# Altium schematic sheet motordriver-v5.0_top-level.SchDoc
size 863 x 558 mm; SheetNumber: 1; SheetTotal: 13
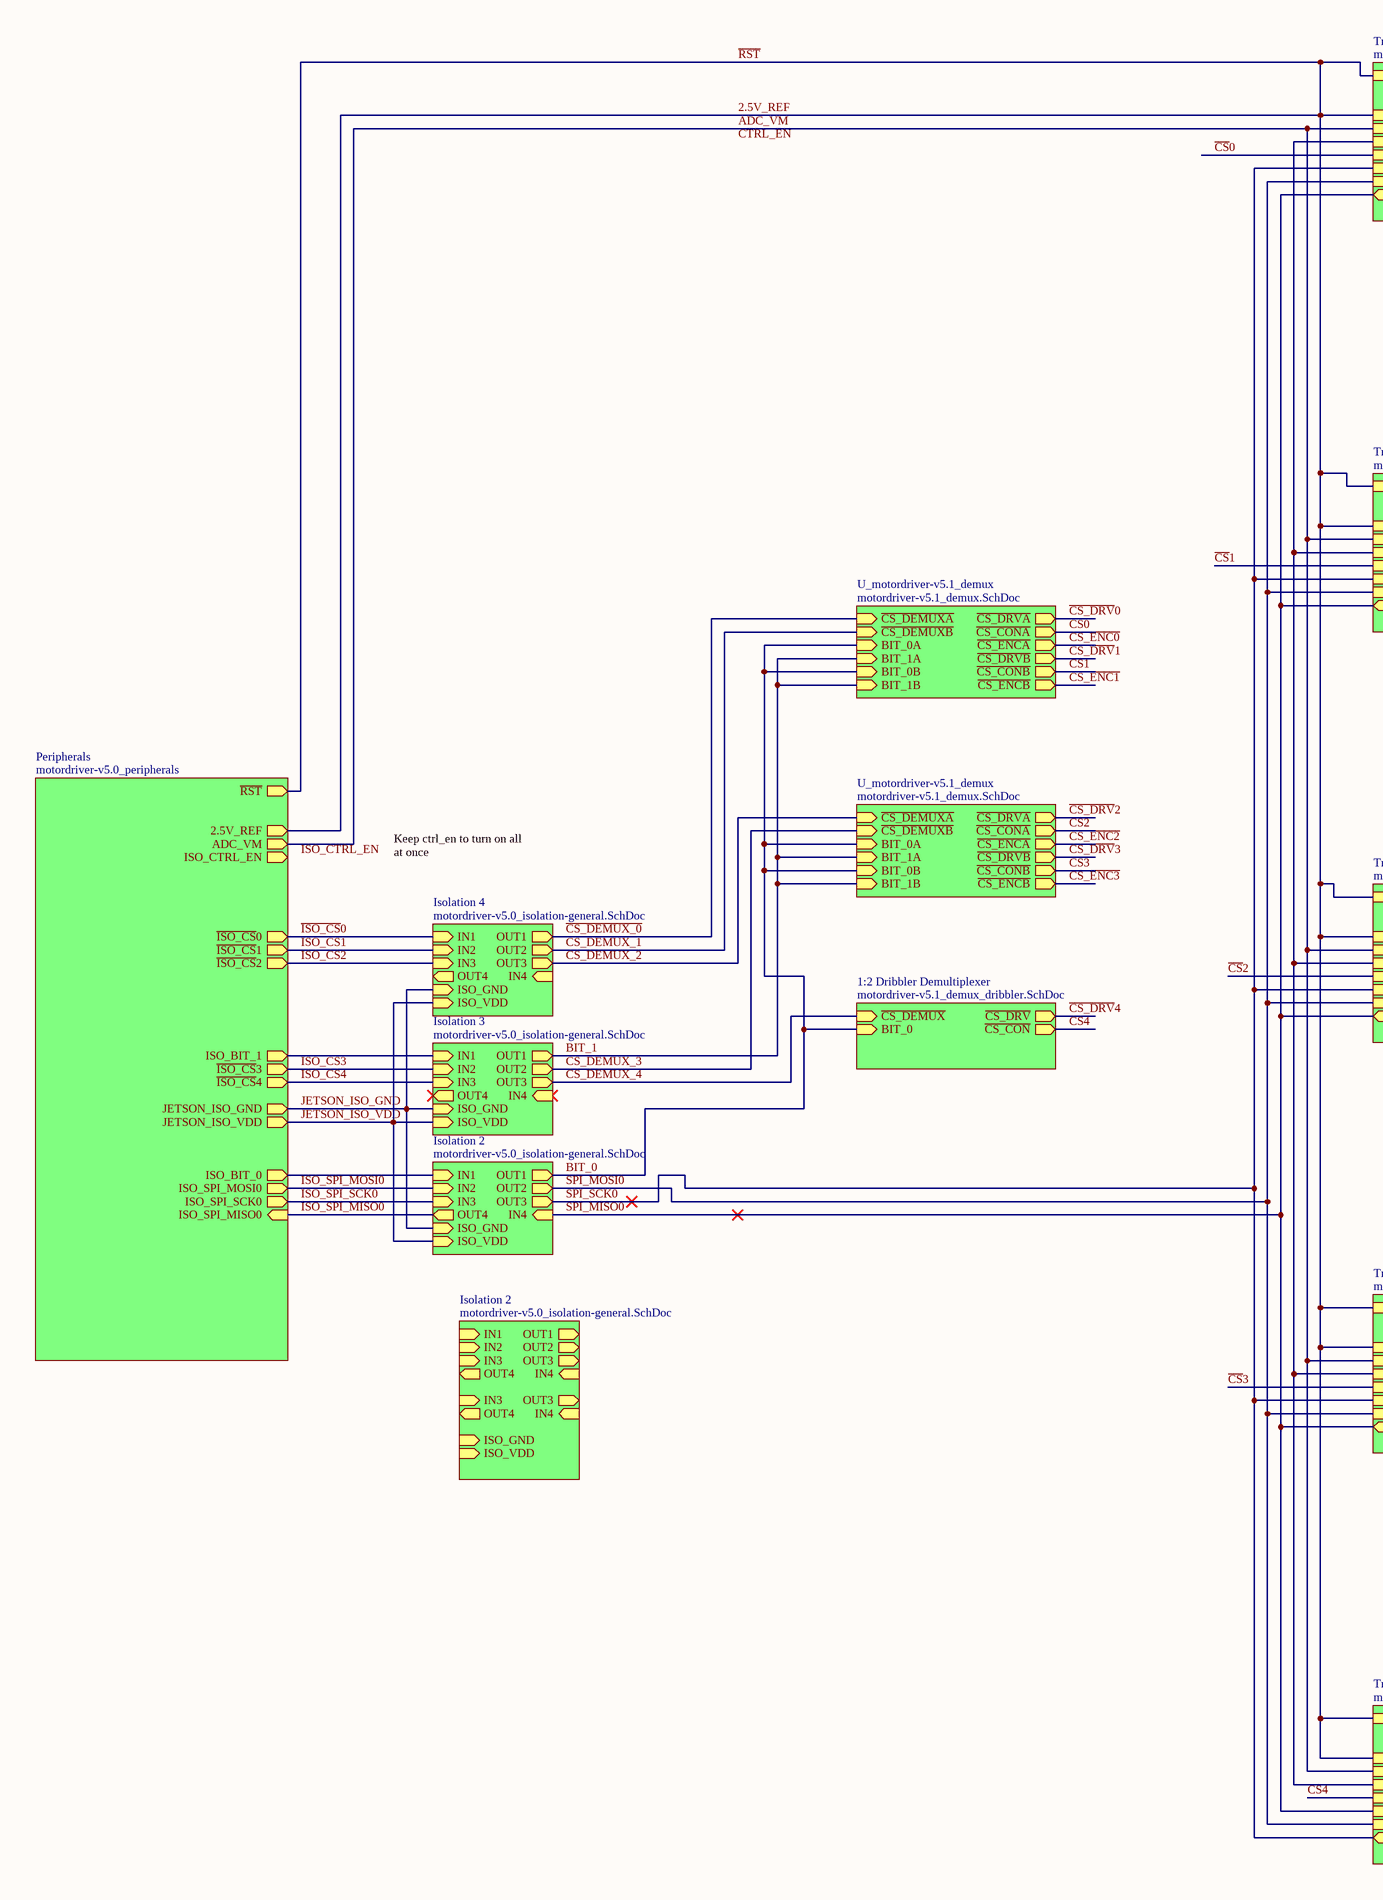
[diagram p0: motordriver-v5.0_top-level.SchDoc, left]
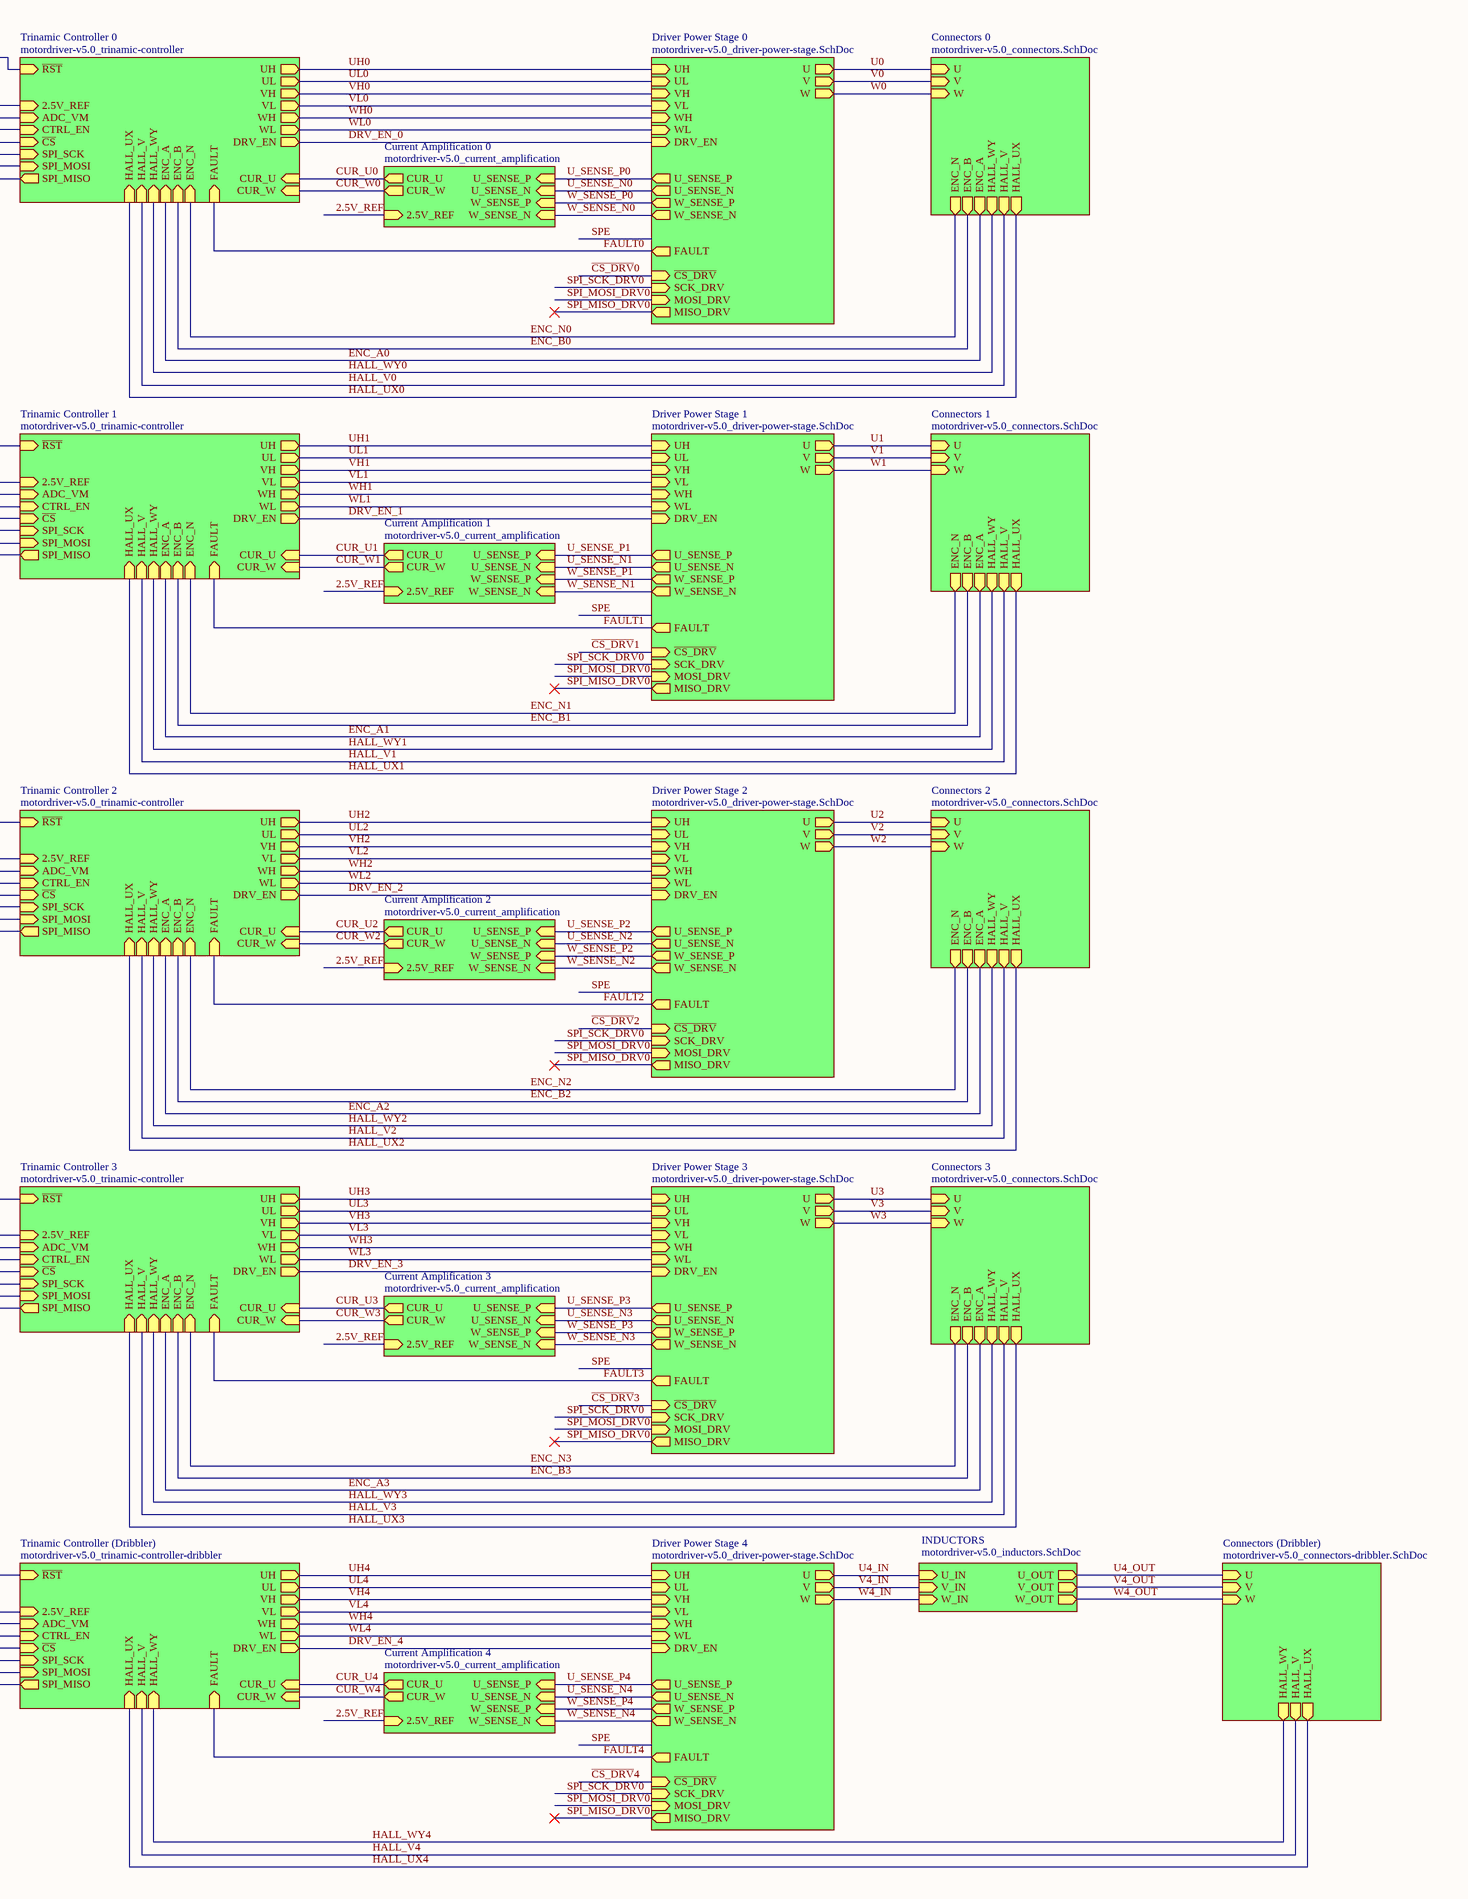
[diagram p1: motordriver-v5.0_top-level.SchDoc, right]

## Sub-sheets
1:2 Dribbler Demultiplexer = motordriver-v5.1_demux_dribbler.SchDoc: ~{CS_DRV} (out), ~{CS_CON} (out), ~{CS_DEMUX} (in), BIT_0 (in)
Connectors 0 = motordriver-v5.0_connectors.SchDoc: U (in), V (in), W (in), HALL_UX (out), HALL_V (out), HALL_WY (out), ENC_A (out), ENC_B (out), ENC_N (out)
Connectors 1 = motordriver-v5.0_connectors.SchDoc: U (in), V (in), W (in), HALL_UX (out), HALL_V (out), HALL_WY (out), ENC_A (out), ENC_B (out), ENC_N (out)
Connectors 2 = motordriver-v5.0_connectors.SchDoc: U (in), V (in), W (in), HALL_UX (out), HALL_V (out), HALL_WY (out), ENC_A (out), ENC_B (out), ENC_N (out)
Connectors 3 = motordriver-v5.0_connectors.SchDoc: U (in), V (in), W (in), HALL_UX (out), HALL_V (out), HALL_WY (out), ENC_A (out), ENC_B (out), ENC_N (out)
Connectors (Dribbler) = motordriver-v5.0_connectors-dribbler.SchDoc: U (in), V (in), W (in), HALL_UX (out), HALL_V (out), HALL_WY (out)
Current Amplification 0 = motordriver-v5.0_current_amplification: CUR_U (out), CUR_W (out), U_SENSE_P (in), U_SENSE_N (in), W_SENSE_N (in), W_SENSE_P (in), 2.5V_REF (in)
Current Amplification 1 = motordriver-v5.0_current_amplification: CUR_U (out), CUR_W (out), U_SENSE_P (in), U_SENSE_N (in), W_SENSE_N (in), W_SENSE_P (in), 2.5V_REF (in)
Current Amplification 2 = motordriver-v5.0_current_amplification: CUR_U (out), CUR_W (out), U_SENSE_P (in), U_SENSE_N (in), W_SENSE_N (in), W_SENSE_P (in), 2.5V_REF (in)
Current Amplification 3 = motordriver-v5.0_current_amplification: CUR_U (out), CUR_W (out), U_SENSE_P (in), U_SENSE_N (in), W_SENSE_N (in), W_SENSE_P (in), 2.5V_REF (in)
Current Amplification 4 = motordriver-v5.0_current_amplification: CUR_U (out), CUR_W (out), U_SENSE_P (in), U_SENSE_N (in), W_SENSE_N (in), W_SENSE_P (in), 2.5V_REF (in)
Driver Power Stage 0 = motordriver-v5.0_driver-power-stage.SchDoc: U (out), V (out), W (out), U_SENSE_P (out), U_SENSE_N (out), DRV_EN (in), UH (in), UL (in), VH (in), VL (in), WH (in), WL (in), FAULT (out), ~{CS_DRV} (in), MISO_DRV (out), MOSI_DRV (in), SCK_DRV (in), W_SENSE_P (out), W_SENSE_N (out)
Driver Power Stage 1 = motordriver-v5.0_driver-power-stage.SchDoc: U (out), V (out), W (out), U_SENSE_P (out), U_SENSE_N (out), DRV_EN (in), UH (in), UL (in), VH (in), VL (in), WH (in), WL (in), FAULT (out), ~{CS_DRV} (in), MISO_DRV (out), MOSI_DRV (in), SCK_DRV (in), W_SENSE_P (out), W_SENSE_N (out)
Driver Power Stage 2 = motordriver-v5.0_driver-power-stage.SchDoc: U (out), V (out), W (out), U_SENSE_P (out), U_SENSE_N (out), DRV_EN (in), UH (in), UL (in), VH (in), VL (in), WH (in), WL (in), FAULT (out), ~{CS_DRV} (in), MISO_DRV (out), MOSI_DRV (in), SCK_DRV (in), W_SENSE_P (out), W_SENSE_N (out)
Driver Power Stage 3 = motordriver-v5.0_driver-power-stage.SchDoc: U (out), V (out), W (out), U_SENSE_P (out), U_SENSE_N (out), DRV_EN (in), UH (in), UL (in), VH (in), VL (in), WH (in), WL (in), FAULT (out), ~{CS_DRV} (in), MISO_DRV (out), MOSI_DRV (in), SCK_DRV (in), W_SENSE_P (out), W_SENSE_N (out)
Driver Power Stage 4 = motordriver-v5.0_driver-power-stage.SchDoc: U (out), V (out), W (out), U_SENSE_P (out), U_SENSE_N (out), DRV_EN (in), UH (in), UL (in), VH (in), VL (in), WH (in), WL (in), FAULT (out), ~{CS_DRV} (in), MISO_DRV (out), MOSI_DRV (in), SCK_DRV (in), W_SENSE_P (out), W_SENSE_N (out)
INDUCTORS = motordriver-v5.0_inductors.SchDoc: U_IN (in), V_IN (in), W_IN (in), V_OUT (out), W_OUT (out), U_OUT (out)
Isolation 2 = motordriver-v5.0_isolation-general.SchDoc: OUT1 (out), IN1 (in), IN2 (in), IN3 (in), OUT4 (out), IN4 (in), OUT3 (out), OUT2 (out), ISO_GND (in), ISO_VDD (in)
Isolation 2 = motordriver-v5.0_isolation-general.SchDoc: OUT1 (out), IN1 (in), IN2 (in), IN3 (in), OUT4 (out), IN4 (in), OUT3 (out), OUT2 (out), ISO_GND (in), ISO_VDD (in), IN3 (in), OUT4 (out), IN4 (in), OUT3 (out)
Isolation 3 = motordriver-v5.0_isolation-general.SchDoc: OUT1 (out), IN1 (in), IN2 (in), IN3 (in), OUT4 (out), IN4 (in), OUT3 (out), OUT2 (out), ISO_GND (in), ISO_VDD (in)
Isolation 4 = motordriver-v5.0_isolation-general.SchDoc: OUT1 (out), IN1 (in), IN2 (in), IN3 (in), OUT4 (out), IN4 (in), OUT3 (out), OUT2 (out), ISO_GND (in), ISO_VDD (in)
Peripherals = motordriver-v5.0_peripherals: ~{RST} (out), ADC_VM (out), ISO_CTRL_EN (out), ISO_SPI_MISO0 (in), JETSON_ISO_VDD (out), JETSON_ISO_GND (out), ~{ISO_CS}1 (out), ~{ISO_CS}2 (out), ~{ISO_CS}4 (out), 2.5V_REF (out), ~{ISO_CS}0 (out), ISO_BIT_1 (out), ~{ISO_CS}3 (out), ISO_SPI_MOSI0 (out), ISO_SPI_SCK0 (out), ISO_BIT_0 (out)
Trinamic Controller 0 = motordriver-v5.0_trinamic-controller: ~{RST} (in), CUR_U (in), CUR_W (in), DRV_EN (out), ADC_VM (in), CTRL_EN (in), UH (out), UL (out), VH (out), VL (out), WH (out), WL (out), HALL_UX (in), HALL_V (in), HALL_WY (in), ENC_A (in), ENC_B (in), ENC_N (in), ~{CS} (in), SPI_MISO (out), SPI_MOSI (in), SPI_SCK (in), 2.5V_REF (in), FAULT (in)
Trinamic Controller 1 = motordriver-v5.0_trinamic-controller: ~{RST} (in), CUR_U (in), CUR_W (in), DRV_EN (out), ADC_VM (in), CTRL_EN (in), UH (out), UL (out), VH (out), VL (out), WH (out), WL (out), HALL_UX (in), HALL_V (in), HALL_WY (in), ENC_A (in), ENC_B (in), ENC_N (in), ~{CS} (in), SPI_MISO (out), SPI_MOSI (in), SPI_SCK (in), 2.5V_REF (in), FAULT (in)
Trinamic Controller 2 = motordriver-v5.0_trinamic-controller: ~{RST} (in), CUR_U (in), CUR_W (in), DRV_EN (out), ADC_VM (in), CTRL_EN (in), UH (out), UL (out), VH (out), VL (out), WH (out), WL (out), HALL_UX (in), HALL_V (in), HALL_WY (in), ENC_A (in), ENC_B (in), ENC_N (in), ~{CS} (in), SPI_MISO (out), SPI_MOSI (in), SPI_SCK (in), 2.5V_REF (in), FAULT (in)
Trinamic Controller 3 = motordriver-v5.0_trinamic-controller: ~{RST} (in), CUR_U (in), CUR_W (in), DRV_EN (out), ADC_VM (in), CTRL_EN (in), UH (out), UL (out), VH (out), VL (out), WH (out), WL (out), HALL_UX (in), HALL_V (in), HALL_WY (in), ENC_A (in), ENC_B (in), ENC_N (in), ~{CS} (in), SPI_MISO (out), SPI_MOSI (in), SPI_SCK (in), 2.5V_REF (in), FAULT (in)
Trinamic Controller (Dribbler) = motordriver-v5.0_trinamic-controller-dribbler: ~{RST} (in), CUR_U (in), CUR_W (in), DRV_EN (out), UH (out), UL (out), VH (out), VL (out), WH (out), WL (out), HALL_UX (in), HALL_V (in), HALL_WY (in), ADC_VM (in), CTRL_EN (in), ~{CS} (in), SPI_MISO (out), SPI_MOSI (in), SPI_SCK (in), 2.5V_REF (in), FAULT (in)
U_motordriver-v5.1_demux = motordriver-v5.1_demux.SchDoc: ~{CS_DEMUXA} (in), ~{CS_DRVA} (out), ~{CS_CONA} (out), ~{CS_ENCA} (out), ~{CS_DEMUXB} (in), ~{CS_DRVB} (out), ~{CS_CONB} (out), ~{CS_ENCB} (out), BIT_0A (in), BIT_1A (in), BIT_0B (in), BIT_1B (in)
U_motordriver-v5.1_demux = motordriver-v5.1_demux.SchDoc: ~{CS_DEMUXA} (in), ~{CS_DRVA} (out), ~{CS_CONA} (out), ~{CS_ENCA} (out), ~{CS_DEMUXB} (in), ~{CS_DRVB} (out), ~{CS_CONB} (out), ~{CS_ENCB} (out), BIT_0A (in), BIT_1A (in), BIT_0B (in), BIT_1B (in)

## Nets
2.5V_REF: sheet Peripherals/~{RST}, sheet Peripherals/2.5V_REF, sheet Trinamic Controller (Dribbler)/~{RST}, sheet Trinamic Controller (Dribbler)/2.5V_REF, sheet Trinamic Controller 0/~{RST}, sheet Trinamic Controller 0/2.5V_REF, sheet Current Amplification 0/2.5V_REF, sheet Trinamic Controller 1/~{RST}, sheet Trinamic Controller 1/2.5V_REF, sheet Current Amplification 1/2.5V_REF, sheet Trinamic Controller 2/~{RST}, sheet Trinamic Controller 2/2.5V_REF, sheet Current Amplification 2/2.5V_REF, sheet Trinamic Controller 3/~{RST}, sheet Trinamic Controller 3/2.5V_REF, sheet Current Amplification 3/2.5V_REF, sheet Current Amplification 4/2.5V_REF  [also labelled ~{RST}]
ADC_VM: sheet Peripherals/ADC_VM, sheet Trinamic Controller (Dribbler)/ADC_VM, sheet Trinamic Controller 0/ADC_VM, sheet Trinamic Controller 1/ADC_VM, sheet Trinamic Controller 2/ADC_VM, sheet Trinamic Controller 3/ADC_VM
BIT_0: sheet Isolation 2/OUT1, sheet 1:2 Dribbler Demultiplexer/BIT_0, sheet U_motordriver-v5.1_demux/BIT_0A, sheet U_motordriver-v5.1_demux/BIT_0B, sheet U_motordriver-v5.1_demux/BIT_0A, sheet U_motordriver-v5.1_demux/BIT_0B
BIT_1: sheet U_motordriver-v5.1_demux/BIT_1A, sheet U_motordriver-v5.1_demux/BIT_1B, sheet U_motordriver-v5.1_demux/BIT_1A, sheet U_motordriver-v5.1_demux/BIT_1B, sheet Isolation 3/OUT1
~{CS}0: sheet Trinamic Controller 0/~{CS}, sheet U_motordriver-v5.1_demux/~{CS_CONA}
~{CS}1: sheet Trinamic Controller 1/~{CS}, sheet U_motordriver-v5.1_demux/~{CS_CONB}
~{CS}2: sheet Trinamic Controller 2/~{CS}, sheet U_motordriver-v5.1_demux/~{CS_CONA}
~{CS}3: sheet Trinamic Controller 3/~{CS}, sheet U_motordriver-v5.1_demux/~{CS_CONB}
~{CS}4: sheet Trinamic Controller (Dribbler)/~{CS}, sheet 1:2 Dribbler Demultiplexer/~{CS_CON}
~{CS_DEMUX_0}: sheet U_motordriver-v5.1_demux/~{CS_DEMUXA}, sheet Isolation 4/OUT1
~{CS_DEMUX_1}: sheet U_motordriver-v5.1_demux/~{CS_DEMUXB}, sheet Isolation 4/OUT2
~{CS_DEMUX_2}: sheet U_motordriver-v5.1_demux/~{CS_DEMUXA}, sheet Isolation 4/OUT3
~{CS_DEMUX_3}: sheet U_motordriver-v5.1_demux/~{CS_DEMUXB}, sheet Isolation 3/OUT2
~{CS_DEMUX_4}: sheet 1:2 Dribbler Demultiplexer/~{CS_DEMUX}, sheet Isolation 3/OUT3
~{CS_DRV}0: sheet Driver Power Stage 0/~{CS_DRV}, sheet U_motordriver-v5.1_demux/~{CS_DRVA}
~{CS_DRV}1: sheet Driver Power Stage 1/~{CS_DRV}, sheet U_motordriver-v5.1_demux/~{CS_DRVB}
~{CS_DRV}2: sheet Driver Power Stage 2/~{CS_DRV}, sheet U_motordriver-v5.1_demux/~{CS_DRVA}
~{CS_DRV}3: sheet Driver Power Stage 3/~{CS_DRV}, sheet U_motordriver-v5.1_demux/~{CS_DRVB}
~{CS_DRV}4: sheet Driver Power Stage 4/~{CS_DRV}, sheet 1:2 Dribbler Demultiplexer/~{CS_DRV}
~{CS_ENC0}: sheet U_motordriver-v5.1_demux/~{CS_ENCA}
~{CS_ENC1}: sheet U_motordriver-v5.1_demux/~{CS_ENCB}
~{CS_ENC2}: sheet U_motordriver-v5.1_demux/~{CS_ENCA}
~{CS_ENC3}: sheet U_motordriver-v5.1_demux/~{CS_ENCB}
CUR_U0: sheet Trinamic Controller 0/CUR_U, sheet Current Amplification 0/CUR_U
CUR_U1: sheet Trinamic Controller 1/CUR_U, sheet Current Amplification 1/CUR_U
CUR_U2: sheet Trinamic Controller 2/CUR_U, sheet Current Amplification 2/CUR_U
CUR_U3: sheet Trinamic Controller 3/CUR_U, sheet Current Amplification 3/CUR_U
CUR_U4: sheet Trinamic Controller (Dribbler)/CUR_U, sheet Current Amplification 4/CUR_U
CUR_W0: sheet Trinamic Controller 0/CUR_W, sheet Current Amplification 0/CUR_W
CUR_W1: sheet Trinamic Controller 1/CUR_W, sheet Current Amplification 1/CUR_W
CUR_W2: sheet Trinamic Controller 2/CUR_W, sheet Current Amplification 2/CUR_W
CUR_W3: sheet Trinamic Controller 3/CUR_W, sheet Current Amplification 3/CUR_W
CUR_W4: sheet Trinamic Controller (Dribbler)/CUR_W, sheet Current Amplification 4/CUR_W
DRV_EN_0: sheet Driver Power Stage 0/DRV_EN, sheet Trinamic Controller 0/DRV_EN
DRV_EN_1: sheet Driver Power Stage 1/DRV_EN, sheet Trinamic Controller 1/DRV_EN
DRV_EN_2: sheet Driver Power Stage 2/DRV_EN, sheet Trinamic Controller 2/DRV_EN
DRV_EN_3: sheet Driver Power Stage 3/DRV_EN, sheet Trinamic Controller 3/DRV_EN
DRV_EN_4: sheet Trinamic Controller (Dribbler)/DRV_EN, sheet Driver Power Stage 4/DRV_EN
ENC_A0: sheet Trinamic Controller 0/ENC_A, sheet Connectors 0/ENC_A
ENC_A1: sheet Trinamic Controller 1/ENC_A, sheet Connectors 1/ENC_A
ENC_A2: sheet Trinamic Controller 2/ENC_A, sheet Connectors 2/ENC_A
ENC_A3: sheet Trinamic Controller 3/ENC_A, sheet Connectors 3/ENC_A
ENC_B0: sheet Trinamic Controller 0/ENC_B, sheet Connectors 0/ENC_B
ENC_B1: sheet Trinamic Controller 1/ENC_B, sheet Connectors 1/ENC_B
ENC_B2: sheet Trinamic Controller 2/ENC_B, sheet Connectors 2/ENC_B
ENC_B3: sheet Trinamic Controller 3/ENC_B, sheet Connectors 3/ENC_B
ENC_N0: sheet Trinamic Controller 0/ENC_N, sheet Connectors 0/ENC_N
ENC_N1: sheet Trinamic Controller 1/ENC_N, sheet Connectors 1/ENC_N
ENC_N2: sheet Trinamic Controller 2/ENC_N, sheet Connectors 2/ENC_N
ENC_N3: sheet Trinamic Controller 3/ENC_N, sheet Connectors 3/ENC_N
FAULT0: sheet Driver Power Stage 0/FAULT, sheet Trinamic Controller 0/FAULT
FAULT1: sheet Driver Power Stage 1/FAULT, sheet Trinamic Controller 1/FAULT
FAULT2: sheet Driver Power Stage 2/FAULT, sheet Trinamic Controller 2/FAULT
FAULT3: sheet Driver Power Stage 3/FAULT, sheet Trinamic Controller 3/FAULT
FAULT4: sheet Trinamic Controller (Dribbler)/FAULT, sheet Driver Power Stage 4/FAULT
HALL_UX0: sheet Trinamic Controller 0/HALL_UX, sheet Connectors 0/HALL_UX
HALL_UX1: sheet Trinamic Controller 1/HALL_UX, sheet Connectors 1/HALL_UX
HALL_UX2: sheet Trinamic Controller 2/HALL_UX, sheet Connectors 2/HALL_UX
HALL_UX3: sheet Trinamic Controller 3/HALL_UX, sheet Connectors 3/HALL_UX
HALL_UX4: sheet Trinamic Controller (Dribbler)/HALL_UX, sheet Connectors (Dribbler)/HALL_UX
HALL_V0: sheet Trinamic Controller 0/HALL_V, sheet Connectors 0/HALL_V
HALL_V1: sheet Trinamic Controller 1/HALL_V, sheet Connectors 1/HALL_V
HALL_V2: sheet Trinamic Controller 2/HALL_V, sheet Connectors 2/HALL_V
HALL_V3: sheet Trinamic Controller 3/HALL_V, sheet Connectors 3/HALL_V
HALL_V4: sheet Trinamic Controller (Dribbler)/HALL_V, sheet Connectors (Dribbler)/HALL_V
HALL_WY0: sheet Trinamic Controller 0/HALL_WY, sheet Connectors 0/HALL_WY
HALL_WY1: sheet Trinamic Controller 1/HALL_WY, sheet Connectors 1/HALL_WY
HALL_WY2: sheet Trinamic Controller 2/HALL_WY, sheet Connectors 2/HALL_WY
HALL_WY3: sheet Trinamic Controller 3/HALL_WY, sheet Connectors 3/HALL_WY
HALL_WY4: sheet Trinamic Controller (Dribbler)/HALL_WY, sheet Connectors (Dribbler)/HALL_WY
~{ISO_CS}0: sheet Peripherals/~{ISO_CS}0, sheet Isolation 4/IN1
~{ISO_CS}1: sheet Peripherals/~{ISO_CS}1, sheet Isolation 4/IN2
~{ISO_CS}2: sheet Peripherals/~{ISO_CS}2, sheet Isolation 4/IN3
~{ISO_CS}3: sheet Peripherals/~{ISO_CS}3, sheet Isolation 3/IN2
~{ISO_CS}4: sheet Peripherals/~{ISO_CS}4, sheet Isolation 3/IN3
ISO_SPI_MISO0: sheet Peripherals/ISO_SPI_MISO0, sheet Isolation 2/OUT4
ISO_SPI_MOSI0: sheet Peripherals/ISO_SPI_MOSI0, sheet Isolation 2/IN2
ISO_SPI_SCK0: sheet Peripherals/ISO_SPI_SCK0, sheet Isolation 2/IN3
JETSON_ISO_GND: sheet Peripherals/JETSON_ISO_GND, sheet Isolation 2/ISO_GND, sheet Isolation 3/ISO_GND, sheet Isolation 4/ISO_GND
JETSON_ISO_VDD: sheet Peripherals/JETSON_ISO_VDD, sheet Isolation 2/ISO_VDD, sheet Isolation 3/ISO_VDD, sheet Isolation 4/ISO_VDD
SPI_MISO0: sheet Trinamic Controller (Dribbler)/SPI_SCK, sheet Trinamic Controller 0/SPI_MISO, sheet Isolation 2/IN4, sheet Trinamic Controller 1/SPI_MISO, sheet Trinamic Controller 2/SPI_MISO, sheet Trinamic Controller 3/SPI_MISO
SPI_MISO_DRV0: sheet Driver Power Stage 0/MISO_DRV, sheet Driver Power Stage 1/MISO_DRV, sheet Driver Power Stage 2/MISO_DRV, sheet Driver Power Stage 3/MISO_DRV, sheet Driver Power Stage 4/MISO_DRV
SPI_MOSI0: sheet Trinamic Controller (Dribbler)/SPI_MOSI, sheet Trinamic Controller 0/SPI_MOSI, sheet Isolation 2/OUT2, sheet Trinamic Controller 1/SPI_MOSI, sheet Trinamic Controller 2/SPI_MOSI, sheet Trinamic Controller 3/SPI_MOSI
SPI_MOSI_DRV0: sheet Driver Power Stage 0/MOSI_DRV, sheet Driver Power Stage 1/MOSI_DRV, sheet Driver Power Stage 2/MOSI_DRV, sheet Driver Power Stage 3/MOSI_DRV, sheet Driver Power Stage 4/MOSI_DRV
SPI_SCK0: sheet Trinamic Controller (Dribbler)/SPI_MISO, sheet Trinamic Controller 0/SPI_SCK, sheet Isolation 2/OUT3, sheet Trinamic Controller 1/SPI_SCK, sheet Trinamic Controller 2/SPI_SCK, sheet Trinamic Controller 3/SPI_SCK
SPI_SCK_DRV0: sheet Driver Power Stage 0/SCK_DRV, sheet Driver Power Stage 1/SCK_DRV, sheet Driver Power Stage 2/SCK_DRV, sheet Driver Power Stage 3/SCK_DRV, sheet Driver Power Stage 4/SCK_DRV
U0: sheet Driver Power Stage 0/U, sheet Connectors 0/U
U1: sheet Driver Power Stage 1/U, sheet Connectors 1/U
U2: sheet Driver Power Stage 2/U, sheet Connectors 2/U
U3: sheet Driver Power Stage 3/U, sheet Connectors 3/U
U4_IN: sheet INDUCTORS/U_IN, sheet Driver Power Stage 4/U
U4_OUT: sheet INDUCTORS/U_OUT, sheet Connectors (Dribbler)/U
U_SENSE_N0: sheet Driver Power Stage 0/U_SENSE_N, sheet Current Amplification 0/U_SENSE_N
U_SENSE_N1: sheet Driver Power Stage 1/U_SENSE_N, sheet Current Amplification 1/U_SENSE_N
U_SENSE_N2: sheet Driver Power Stage 2/U_SENSE_N, sheet Current Amplification 2/U_SENSE_N
U_SENSE_N3: sheet Driver Power Stage 3/U_SENSE_N, sheet Current Amplification 3/U_SENSE_N
U_SENSE_N4: sheet Driver Power Stage 4/U_SENSE_N, sheet Current Amplification 4/U_SENSE_N
U_SENSE_P0: sheet Driver Power Stage 0/U_SENSE_P, sheet Current Amplification 0/U_SENSE_P
U_SENSE_P1: sheet Driver Power Stage 1/U_SENSE_P, sheet Current Amplification 1/U_SENSE_P
U_SENSE_P2: sheet Driver Power Stage 2/U_SENSE_P, sheet Current Amplification 2/U_SENSE_P
U_SENSE_P3: sheet Driver Power Stage 3/U_SENSE_P, sheet Current Amplification 3/U_SENSE_P
U_SENSE_P4: sheet Driver Power Stage 4/U_SENSE_P, sheet Current Amplification 4/U_SENSE_P
UH0: sheet Driver Power Stage 0/UH, sheet Trinamic Controller 0/UH
UH1: sheet Driver Power Stage 1/UH, sheet Trinamic Controller 1/UH
UH2: sheet Driver Power Stage 2/UH, sheet Trinamic Controller 2/UH
UH3: sheet Driver Power Stage 3/UH, sheet Trinamic Controller 3/UH
UH4: sheet Trinamic Controller (Dribbler)/UH, sheet Driver Power Stage 4/UH
UL0: sheet Driver Power Stage 0/UL, sheet Trinamic Controller 0/UL
UL1: sheet Driver Power Stage 1/UL, sheet Trinamic Controller 1/UL
UL2: sheet Driver Power Stage 2/UL, sheet Trinamic Controller 2/UL
UL3: sheet Driver Power Stage 3/UL, sheet Trinamic Controller 3/UL
UL4: sheet Trinamic Controller (Dribbler)/UL, sheet Driver Power Stage 4/UL
V0: sheet Driver Power Stage 0/V, sheet Connectors 0/V
V1: sheet Driver Power Stage 1/V, sheet Connectors 1/V
V2: sheet Driver Power Stage 2/V, sheet Connectors 2/V
V3: sheet Driver Power Stage 3/V, sheet Connectors 3/V
V4_IN: sheet INDUCTORS/V_IN, sheet Driver Power Stage 4/V
V4_OUT: sheet INDUCTORS/V_OUT, sheet Connectors (Dribbler)/V
VH0: sheet Driver Power Stage 0/VH, sheet Trinamic Controller 0/VH
VH1: sheet Driver Power Stage 1/VH, sheet Trinamic Controller 1/VH
VH2: sheet Driver Power Stage 2/VH, sheet Trinamic Controller 2/VH
VH3: sheet Driver Power Stage 3/VH, sheet Trinamic Controller 3/VH
VH4: sheet Trinamic Controller (Dribbler)/VH, sheet Driver Power Stage 4/VH
VL0: sheet Driver Power Stage 0/VL, sheet Trinamic Controller 0/VL
VL1: sheet Driver Power Stage 1/VL, sheet Trinamic Controller 1/VL
VL2: sheet Driver Power Stage 2/VL, sheet Trinamic Controller 2/VL
VL3: sheet Driver Power Stage 3/VL, sheet Trinamic Controller 3/VL
VL4: sheet Trinamic Controller (Dribbler)/VL, sheet Driver Power Stage 4/VL
W0: sheet Driver Power Stage 0/W, sheet Connectors 0/W
W1: sheet Driver Power Stage 1/W, sheet Connectors 1/W
W2: sheet Driver Power Stage 2/W, sheet Connectors 2/W
W3: sheet Driver Power Stage 3/W, sheet Connectors 3/W
W4_IN: sheet INDUCTORS/W_IN, sheet Driver Power Stage 4/W
W4_OUT: sheet INDUCTORS/W_OUT, sheet Connectors (Dribbler)/W
W_SENSE_N0: sheet Driver Power Stage 0/W_SENSE_N, sheet Current Amplification 0/W_SENSE_N
W_SENSE_N1: sheet Driver Power Stage 1/W_SENSE_N, sheet Current Amplification 1/W_SENSE_N
W_SENSE_N2: sheet Driver Power Stage 2/W_SENSE_N, sheet Current Amplification 2/W_SENSE_N
W_SENSE_N3: sheet Driver Power Stage 3/W_SENSE_N, sheet Current Amplification 3/W_SENSE_N
W_SENSE_N4: sheet Driver Power Stage 4/W_SENSE_N, sheet Current Amplification 4/W_SENSE_N
W_SENSE_P0: sheet Driver Power Stage 0/W_SENSE_P, sheet Current Amplification 0/W_SENSE_P
W_SENSE_P1: sheet Driver Power Stage 1/W_SENSE_P, sheet Current Amplification 1/W_SENSE_P
W_SENSE_P2: sheet Driver Power Stage 2/W_SENSE_P, sheet Current Amplification 2/W_SENSE_P
W_SENSE_P3: sheet Driver Power Stage 3/W_SENSE_P, sheet Current Amplification 3/W_SENSE_P
W_SENSE_P4: sheet Driver Power Stage 4/W_SENSE_P, sheet Current Amplification 4/W_SENSE_P
WH0: sheet Driver Power Stage 0/WH, sheet Trinamic Controller 0/WH
WH1: sheet Driver Power Stage 1/WH, sheet Trinamic Controller 1/WH
WH2: sheet Driver Power Stage 2/WH, sheet Trinamic Controller 2/WH
WH3: sheet Driver Power Stage 3/WH, sheet Trinamic Controller 3/WH
WH4: sheet Trinamic Controller (Dribbler)/WH, sheet Driver Power Stage 4/WH
WL0: sheet Driver Power Stage 0/WL, sheet Trinamic Controller 0/WL
WL1: sheet Driver Power Stage 1/WL, sheet Trinamic Controller 1/WL
WL2: sheet Driver Power Stage 2/WL, sheet Trinamic Controller 2/WL
WL3: sheet Driver Power Stage 3/WL, sheet Trinamic Controller 3/WL
WL4: sheet Trinamic Controller (Dribbler)/WL, sheet Driver Power Stage 4/WL
(unnamed): sheet Peripherals/ISO_BIT_1, sheet Isolation 3/IN1
(unnamed): sheet Peripherals/ISO_BIT_0, sheet Isolation 2/IN1
(unnamed): sheet Trinamic Controller (Dribbler)/CTRL_EN, sheet Trinamic Controller 0/CTRL_EN, sheet Trinamic Controller 1/CTRL_EN, sheet Trinamic Controller 2/CTRL_EN, sheet Trinamic Controller 3/CTRL_EN

## Notes on the sheet
- Keep ctrl_en to turn on all at once
- Labels drawn without touching a wire or pin: CTRL_EN, ISO_CTRL_EN
- DWG. NO.
- REV.
- SHT.
- REVISION
- DESCRIPTION
- DATE
- APPROVED
- THIS DOCUMENT AND THE DATA DISCLOSED HEREIN OR HEREWITH IS THE PROPERTY OF ALTIUM LIMITED AND MAY BE FREELY DISTRIBUTED IN WHOLE. NO RIGHTS ARE RESERVED OR EXPRESS OR IMPLIED WARANTEE GIVEN.
- ENG:
- DSN:
- APPROVALS
- PROJECT
- DOCUMENT REVISION:
- DESIGN ITEM:
- CHK:
- BOM:
- REFERENCE DOCUMENTS
- PROJECT REVISION:
- TITLE
- FAB DWG:
- PCB DWG:
- ASSY DWG:
- SCALE:
- SIZE
- D
- CAGE CODE
- FILE NAME
- DWG NO.
- SHEET
- OF
- REV